# Altium project PaneLED.PrjPCB
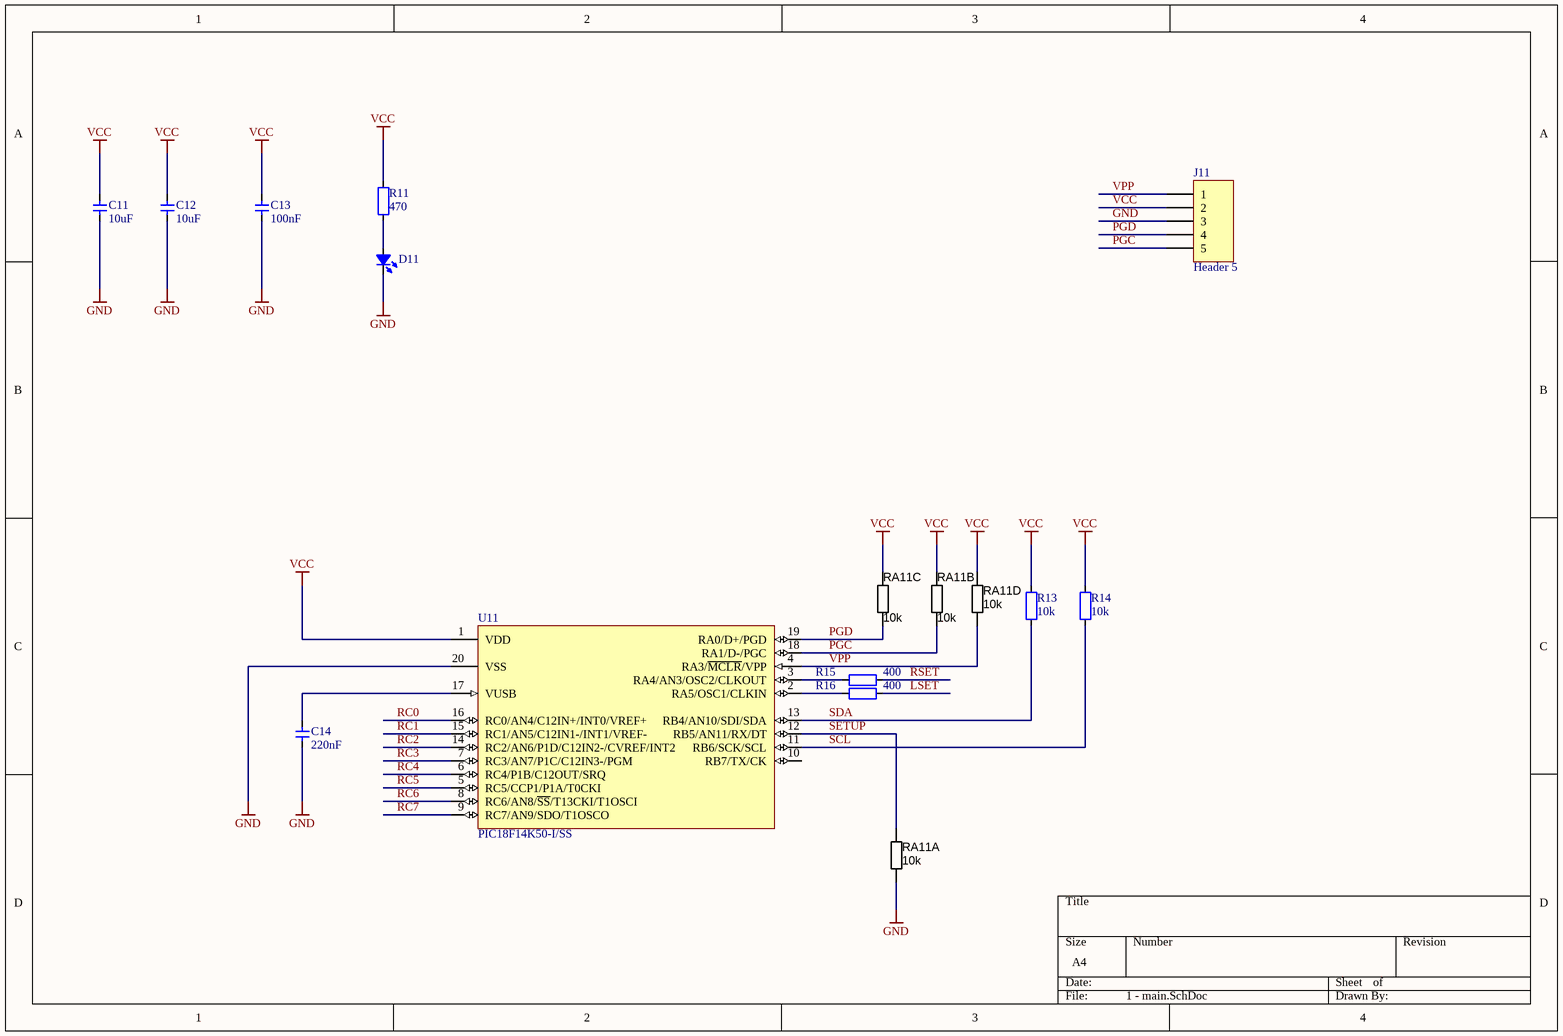
[diagram p0: 1 - main.SchDoc]
3 sheets, 28 parts. Net scope: global (net labels, ports and power ports of the same name join across sheets).
Board file: main.PcbDoc
Sheets:
  1 - main.SchDoc
  2 - ports.SchDoc
  3 - display.SchDoc

## Sheet 1 - main.SchDoc
size A4

### Parts
C11  value 10uF  [CAP_0603]  (hidden comment: Cap_0603)
C12  value 10uF  [CAP_0603]  (hidden comment: Cap_0603)
C13  value 100nF  [CAP_0603]  (hidden comment: Cap_0603)
C14  value 220nF  [CAP_0603]  (hidden comment: Cap_0603)
D11  LED_0603  [LED_0603_RED]  (value not drawn)
J11  Header 5  [HDR1X5]
R11  value 470  [RES_0603]  (hidden comment: Res_0603)
R13  value 10k  [RES_0603]  (hidden comment: Res_0603)
R14  value 10k  [RES_0603]  (hidden comment: Res_0603)
R15  value 400  [RES_0603]  (hidden comment: Res_0603)
R16  value 400  [RES_0603]  (hidden comment: Res_0603)
RA11  value 10k  [RESCAXS50P160X320X70-8N]  (hidden comment: Film Res Pack)  (parts A,B,C,D of 4)
U11  PIC18F14K50-I/SS  [SSOP-SS20_N]

### Nets
GND: C11.1 C12.1 C13.1 C14.1 D11.2(K) J11.3 RA11.8 U11.20(VSS)
VCC: C11.2 C12.2 C13.2 J11.2 R11.2 R13.2 R14.2 RA11.5 RA11.6 RA11.7 U11.1(VDD)
LSET: R16.1
PGC: J11.5 RA11.2 U11.18(RA1/D-/PGC)
PGD: J11.4 RA11.3 U11.19(RA0/D+/PGD)
RC0: U11.16(RC0/AN4/C12IN+/INT0/VREF+)
RC1: U11.15(RC1/AN5/C12IN1-/INT1/VREF-)
RC2: U11.14(RC2/AN6/P1D/C12IN2-/CVREF/INT2)
RC3: U11.7(RC3/AN7/P1C/C12IN3-/PGM)
RC4: U11.6(RC4/P1B/C12OUT/SRQ)
RC5: U11.5(RC5/CCP1/P1A/T0CKI)
RC6: U11.8(RC6/AN8/~{SS}/T13CKI/T1OSCI)
RC7: U11.9(RC7/AN9/SDO/T1OSCO)
RSET: R15.1
SCL: R14.1 U11.11(RB6/SCK/SCL)
SDA: R13.1 U11.13(RB4/AN10/SDI/SDA)
SETUP: RA11.1 U11.12(RB5/AN11/RX/DT)
VPP: J11.1 RA11.4 U11.4(RA3/~{MCLR}/VPP)
NetC14_2: C14.2 U11.17(VUSB)
NetD11_1: D11.1(A) R11.1
NetR15_2: R15.2 U11.3(RA4/AN3/OSC2/CLKOUT)
NetR16_2: R16.2 U11.2(RA5/OSC1/CLKIN)

Not connected (* = marked no-connect by the designer): U11 10(RB7/TX/CK)

### Library data of the parts
C11-C14 = Cap_0603: Capacitor
D11 = LED_0603: LED
J11 = Header 5: Header, 5-Pin; LatestRevisionDate: 17-Jul-2002; LatestRevisionNote: Re-released for DXP Platform.; Publisher: Altium Limited
R11 R13-R16 = Res_0603: Resistor
RA11 = RESPACK_1K_5%_4X: Resistor array 1K Ohm 4-pack 62.5mW 5% 4x1608 SMD; Manufacturer 1: Yageo; Manufacturer Part Number 1: YC164-JR-071KL; Ratings: 1/16 W; Number of Resistors: 4; Circuit Type: Isolated; SCDType: source; Package / Case: 1206 (3216 Metric), Convex; Tolerance: ±5%; Number of Pins: 8; Power Per Element: 62.5mW; Mounting Type: Surface Mount; Supplier Device Package: 4 x 0603; Operating Temperature: -55°C ~ 155°C; ComponentLink1URL: http://www.yageo.com/documents/recent/PYu-YC_TC164_51_RoHS_L_3.pdf; ComponentLink1Description: http://www.yageo.com/documents/recent/PYu-YC_TC164_51_RoHS_L_3.pdf; Supplier 1: Digi-Key; Supplier Part Number 1: YC164J-1.0KCT-ND; Supplier 2: Digi-Key; Supplier Part Number 2: CRA6S81.0KCT-ND; Manufacturer 2: Vishay Dale; Manufacturer Part Number 2: CRA06S0831K00JTA; ComponentLink2URL: http://www.vishay.com/doc?31002; ComponentLink2Description: http://www.vishay.com/doc?31002; Supplier 3: Digi-Key; Supplier Part Number 3: RAVF164DJT1K00CT-ND; Manufacturer 3: Stackpole Electronics Inc; Manufacturer Part Number 3: RAVF164DJT1K00; RoHS 3: RoHS Compliant; Size / Dimension: 0.126" L x 0.063" W (3.20mm x 1.60mm); ComponentLink3URL: http://www.seielect.com/Catalog/SEI-RAVF.pdf; ComponentLink3Description: http://www.seielect.com/Catalog/SEI-RAVF.pdf; Supplier 4: Digi-Key; Supplier Part Number 4: Y9102CT-ND; Manufacturer 4: Panasonic Electronic Components; Manufacturer Part Number 4: EXB-38V102JV; RoHS 4: RoHS Compliant; ComponentLink4URL: http://industrial.panasonic.com/www-cgi/jvcr13pz.cgi?E+PZ+3+AOC0001+EXB38V102JV+7+WW; ComponentLink4Description: http://industrial.panasonic.com/www-cgi/jvcr13pz.cgi?E+PZ+3+AOC0001+EXB38V102JV+7+WW; Manufacturer Part Number 5: 4D03WGJ0102T5E; Manufacturer 5: Royal Ohm
U11 = PIC18F14K50-I/SS: USB Flash Microcontroller with nanoWatt XLP Technology, 20-pin SSOP, Industrial Temperature; Published: 2-Dec-2009; DatasheetVersion: revC, Mar-2009; PackageVersion: revBB, Aug-2009; PackageReference: SSOP-SS20; Publisher: Altium Limited; PackageDescription: 20-Lead Plastic Shrink Small Outline (SS) - 5.3mm Body [SSOP]; Supplier 1: Digi-Key; Supplier Part Number 1: PIC18F14K50-I/SS-ND; Supplier 2: Farnell; Supplier Part Number 2: 1648504; Code_JEDEC: MO-150; Code_IPC: SOP65P780-20; ComponentLink1Description: Datasheet; ComponentLink1URL: http://ww1.microchip.com/downloads/en/DeviceDoc/41350C.pdf; ComponentLink2Description: Packaging Specification; ComponentLink2URL: http://www.microchip.com/stellent/groups/techpub_sg/documents/packagingspec/en012702.pdf; ComponentLink3Description: Microchip.com Home; ComponentLink3URL: http://www.microchip.com/

## Sheet 2 - ports.SchDoc
size A4
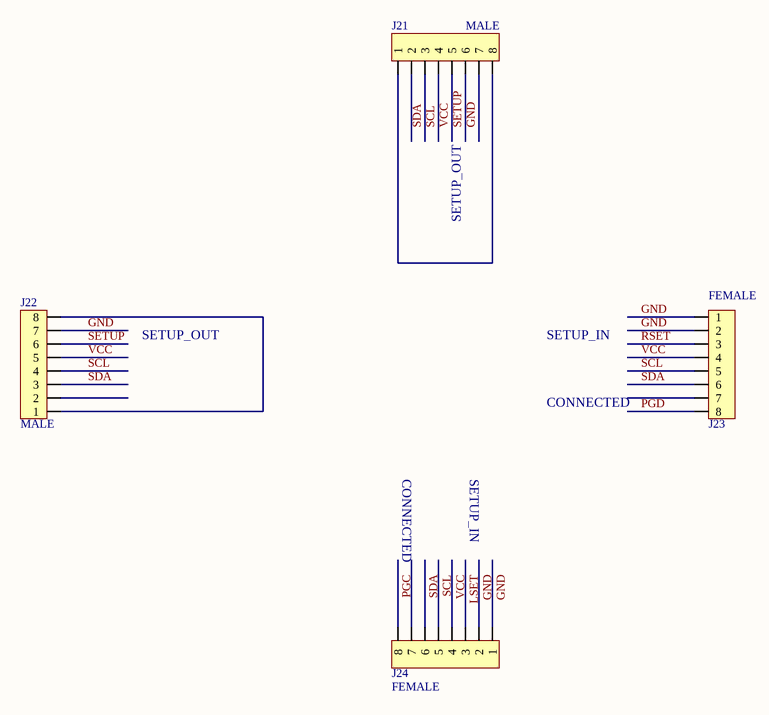
[diagram p1: 2 - ports.SchDoc]

### Parts
J21  MALE  [HDR1X8_2.54_180H]
J22  MALE  [HDR1X8_2.54_180H]
J23  FEMALE  [HDR1X8_2.54_180H]
J24  FEMALE  [HDR1X8_2.54_180H]

### Nets
GND: J21.7 J22.7 J23.1 J23.2 J24.1 J24.2
VCC: J21.5 J22.5 J23.4 J24.4
LSET: J24.3
PGC: J24.8
PGD: J23.8
RSET: J23.3
SCL: J21.4 J22.4 J23.5 J24.5
SDA: J21.3 J22.3 J23.6 J24.6
SETUP: J21.6 J22.6
NetJ21_1: J21.1 J21.8
NetJ22_1: J22.1 J22.8

Not connected (* = marked no-connect by the designer): J21 2; J22 2; J23 7; J24 7

### Notes on the sheet
- SETUP_OUT
- SETUP_IN
- CONNECTED

### Library data of the parts
J21-J24 = HDR1x8_2.54: Header

## Sheet 3 - display.SchDoc
size A4
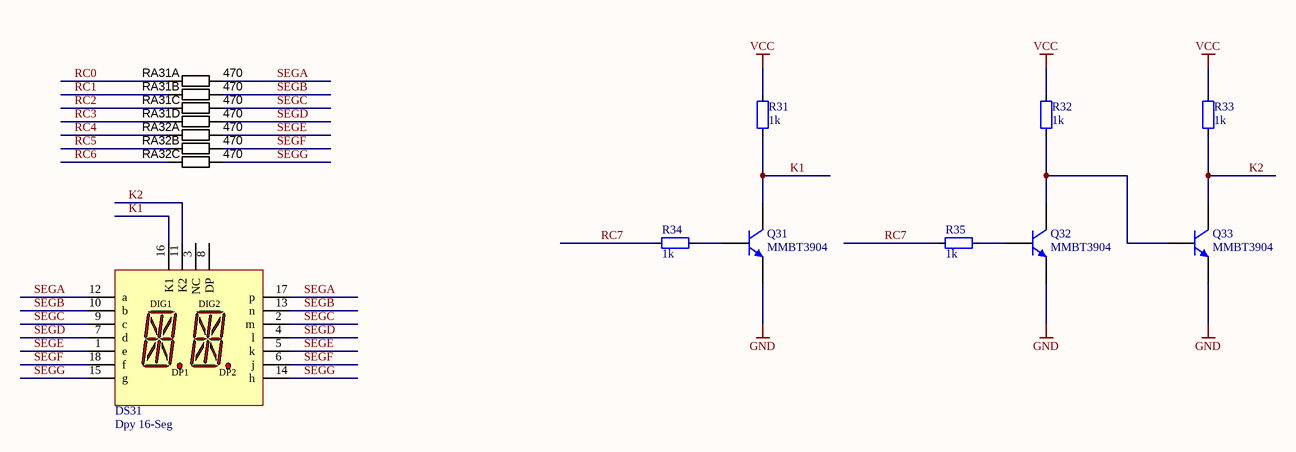
[diagram p2: 3 - display.SchDoc]

### Parts
DS31  Dpy 16-Seg  [HDSP-A2]
Q31  MMBT3904  [SOT23_N]
Q32  MMBT3904  [SOT23_N]
Q33  MMBT3904  [SOT23_N]
R31  value 1k  [RES_0603]  (hidden comment: Res_0603)
R32  value 1k  [RES_0603]  (hidden comment: Res_0603)
R33  value 1k  [RES_0603]  (hidden comment: Res_0603)
R34  value 1k  [RES_0603]  (hidden comment: Res_0603)
R35  value 1k  [RES_0603]  (hidden comment: Res_0603)
RA31  value 470  [RESCAXS50P160X320X70-8N]  (hidden comment: Film Res Pack)  (parts A,B,C,D of 4)
RA32  value 470  [RESCAXS50P160X320X70-8N]  (hidden comment: Film Res Pack)  (parts A,B,C of 4)

### Nets
GND: Q31.2(E) Q32.2(E) Q33.2(E)
VCC: R31.2 R32.2 R33.2
K1: DS31.16(K1) Q31.3(C) R31.1
K2: DS31.11(K2) Q33.3(C) R33.1
RC0: RA31.1
RC1: RA31.2
RC2: RA31.3
RC3: RA31.4
RC4: RA32.1
RC5: RA32.2
RC6: RA32.3
RC7: R34.2 R35.2
SEGA: DS31.12(a) DS31.17(p) RA31.8
SEGB: DS31.10(b) DS31.13(n) RA31.7
SEGC: DS31.2(m) DS31.9(c) RA31.6
SEGD: DS31.4(l) DS31.7(d) RA31.5
SEGE: DS31.1(e) DS31.5(k) RA32.8
SEGF: DS31.6(j) DS31.18(f) RA32.7
SEGG: DS31.14(h) DS31.15(g) RA32.6
NetQ31_1: Q31.1(B) R34.1
NetQ32_1: Q32.1(B) R35.1
NetQ32_3: Q32.3(C) Q33.1(B) R32.1

Not connected (* = marked no-connect by the designer): DS31 3(NC) 8(DP)

### Notes on the sheet
- (in symbol Dpy 16-Seg) DIG1; DIG2; DP1; DP2

### Library data of the parts
DS31 = Dpy 16-Seg: 13.7 mm Gray Surface As AlInGaP Red Alphanumeric Display: 2-Character, CC; Published: 8-Jun-2000; LatestRevisionDate: 17-Dec-2003; LatestRevisionNote: Schematic revised, PCB Footprint replaced.; DatasheetVersion: 20-Nov-2001; PackageVersion: 20-Nov-2001; PackageReference: HDSP-A2; Publisher: Altium Limited; PackageDescription: LED, Alphanumeric Display, 13.8 mm, Dual Character; 18 Leads; Row Space 15.24 mm; Pitch 2.54 mm; Colour: As AlInGaP Red; ComponentLink1Description: Manufacturer Link; ComponentLink1URL: http://www.agilent.com/
Q31-Q33 = MMBT3904: NPN Switching Transistor; Published: 17-Sep-2003; LatestRevisionDate: 12-Dec-2006; LatestRevisionNote: IPC-7351 Footprint Added.; DatasheetVersion: 13-May-2002; PackageVersion: May-1999; PackageReference: SOT23; Publisher: Altium Limited; PackageDescription: 3-Pin SOT-23 Package 0.95 mm Pitch, 2.3 mm Lead Span; ComponentLink1Description: Manufacturer Link; ComponentLink1URL: http://www.semiconductors.philips.com/; ComponentLink2Description: Datasheet; ComponentLink2URL: http://www.semiconductors.philips.com/acrobat/datasheets/MMBT3904_4.pdf; Supplier Part Number 1: MMBT3904FSCT-ND; Supplier 1: Digi-Key
R31-R35 = Res_0603: Resistor
RA31 RA32 = RESPACK_1K_5%_4X: as RA11 on sheet 1 - main; Package / Case: 1206 (3216 Metric), Convex; Tolerance: ±5%; Number of Pins: 8; Power Per Element: 62.5mW; Mounting Type: Surface Mount; Supplier Device Package: 4 x 0603; Operating Temperature: -55°C ~ 155°C; ComponentLink1URL: http://www.yageo.com/documents/recent/PYu-YC_TC164_51_RoHS_L_3.pdf; ComponentLink1Description: http://www.yageo.com/documents/recent/PYu-YC_TC164_51_RoHS_L_3.pdf; Supplier 1: Digi-Key; Supplier Part Number 1: YC164J-1.0KCT-ND; Supplier 2: Digi-Key; Supplier Part Number 2: CRA6S81.0KCT-ND; Manufacturer 2: Vishay Dale; Manufacturer Part Number 2: CRA06S0831K00JTA; ComponentLink2URL: http://www.vishay.com/doc?31002; ComponentLink2Description: http://www.vishay.com/doc?31002; Supplier 3: Digi-Key; Supplier Part Number 3: RAVF164DJT1K00CT-ND; Manufacturer 3: Stackpole Electronics Inc; Manufacturer Part Number 3: RAVF164DJT1K00; RoHS 3: RoHS Compliant; Size / Dimension: 0.126" L x 0.063" W (3.20mm x 1.60mm); ComponentLink3URL: http://www.seielect.com/Catalog/SEI-RAVF.pdf; ComponentLink3Description: http://www.seielect.com/Catalog/SEI-RAVF.pdf; Supplier 4: Digi-Key; Supplier Part Number 4: Y9102CT-ND; Manufacturer 4: Panasonic Electronic Components; Manufacturer Part Number 4: EXB-38V102JV; RoHS 4: RoHS Compliant; ComponentLink4URL: http://industrial.panasonic.com/www-cgi/jvcr13pz.cgi?E+PZ+3+AOC0001+EXB38V102JV+7+WW; ComponentLink4Description: http://industrial.panasonic.com/www-cgi/jvcr13pz.cgi?E+PZ+3+AOC0001+EXB38V102JV+7+WW; Manufacturer Part Number 5: 4D03WGJ0102T5E; Manufacturer 5: Royal Ohm

## Nets that join several sheets
GND: 1 - main (8 pins), 2 - ports (6 pins), 3 - display (Q31.2 Q32.2 Q33.2)
VCC: 1 - main (11 pins), 2 - ports (J21.5 J22.5 J23.4 J24.4), 3 - display (R31.2 R32.2 R33.2)
LSET: 1 - main (R16.1), 2 - ports (J24.3)
PGC: 1 - main (J11.5 RA11.2 U11.18), 2 - ports (J24.8)
PGD: 1 - main (J11.4 RA11.3 U11.19), 2 - ports (J23.8)
RC0: 1 - main (U11.16), 3 - display (RA31.1)
RC1: 1 - main (U11.15), 3 - display (RA31.2)
RC2: 1 - main (U11.14), 3 - display (RA31.3)
RC3: 1 - main (U11.7), 3 - display (RA31.4)
RC4: 1 - main (U11.6), 3 - display (RA32.1)
RC5: 1 - main (U11.5), 3 - display (RA32.2)
RC6: 1 - main (U11.8), 3 - display (RA32.3)
RC7: 1 - main (U11.9), 3 - display (R34.2 R35.2)
RSET: 1 - main (R15.1), 2 - ports (J23.3)
SCL: 1 - main (R14.1 U11.11), 2 - ports (J21.4 J22.4 J23.5 J24.5)
SDA: 1 - main (R13.1 U11.13), 2 - ports (J21.3 J22.3 J23.6 J24.6)
SETUP: 1 - main (RA11.1 U11.12), 2 - ports (J21.6 J22.6)